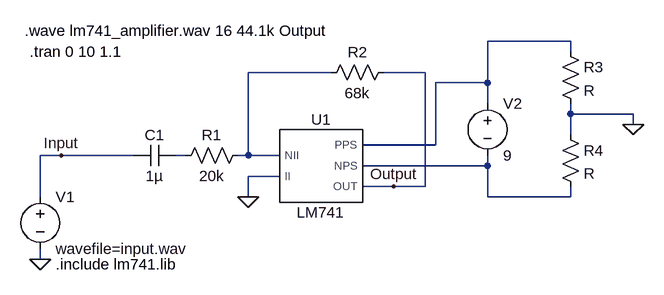
[diagram p0: schematic lm741_amplifier.asc]
lm741_amplifier.asc, the LTspice schematic file:
Version 4
SHEET 1 880 680
WIRE 512 112 384 112
WIRE 512 128 512 112
WIRE 144 160 16 160
WIRE 288 160 224 160
WIRE 384 176 384 112
WIRE 384 176 304 176
WIRE 384 208 384 176
WIRE 512 224 512 208
WIRE 608 224 512 224
WIRE 608 240 608 224
WIRE 512 256 512 224
WIRE 304 272 304 176
WIRE 304 272 192 272
WIRE -272 288 -304 288
WIRE -160 288 -272 288
WIRE -80 288 -96 288
WIRE 16 288 16 160
WIRE 16 288 0 288
WIRE 64 288 16 288
WIRE 384 304 384 288
WIRE 384 304 192 304
WIRE 64 320 16 320
WIRE 240 336 192 336
WIRE 288 336 288 160
WIRE 288 336 240 336
WIRE -304 352 -304 288
WIRE 16 352 16 320
WIRE 384 352 384 304
WIRE 512 352 512 336
WIRE 512 352 384 352
WIRE -304 448 -304 432
FLAG 16 352 0
FLAG -304 448 0
FLAG 240 336 Output
FLAG -272 288 Input
FLAG 608 240 0
SYMBOL res 16 272 R90
WINDOW 0 0 56 VBottom 2
WINDOW 3 32 56 VTop 2
SYMATTR InstName R1
SYMATTR Value 20k
SYMBOL cap -96 272 R90
WINDOW 0 0 32 VBottom 2
WINDOW 3 32 32 VTop 2
SYMATTR InstName C1
SYMATTR Value 1µ
SYMBOL res 240 144 R90
WINDOW 0 0 56 VBottom 2
WINDOW 3 32 56 VTop 2
SYMATTR InstName R2
SYMATTR Value 68k
SYMBOL voltage -304 336 R0
SYMATTR InstName V1
SYMATTR Value wavefile=input.wav
SYMBOL voltage 384 192 R0
WINDOW 123 0 0 Left 0
WINDOW 39 0 0 Left 0
SYMATTR InstName V2
SYMATTR Value 9
SYMBOL AutoGenerated\\LM741 128 304 R0
SYMATTR InstName U1
SYMBOL res 496 112 R0
SYMATTR InstName R3
SYMBOL res 496 240 R0
SYMATTR InstName R4
TEXT -280 456 Left 2 !.include lm741.lib
TEXT -328 96 Left 2 !.wave lm741_amplifier.wav 16 44.1k Output
TEXT -320 128 Left 2 !.tran 0 10 1.1

The netlist it stands for:
* lm741_amplifier.asc
R1 N002 N003 20k
C1 N003 Input 1µ
R2 Output N002 68k
V1 Input 0 wavefile=input.wav
V2 N001 N004 9
XU1 N002 0 N001 N004 Output LM741  ; pins NII II PPS NPS OUT
R3 N001 0 R
R4 0 N004 R
.include lm741.lib
.wave lm741_amplifier.wav 16 44.1k Output
.tran 0 10 1.1
.lib Z:\home\hubertus\Documents\LTspiceXVII\lm741.lib
.backanno
.end